# Altium schematic sheet Main.SchDoc
size A
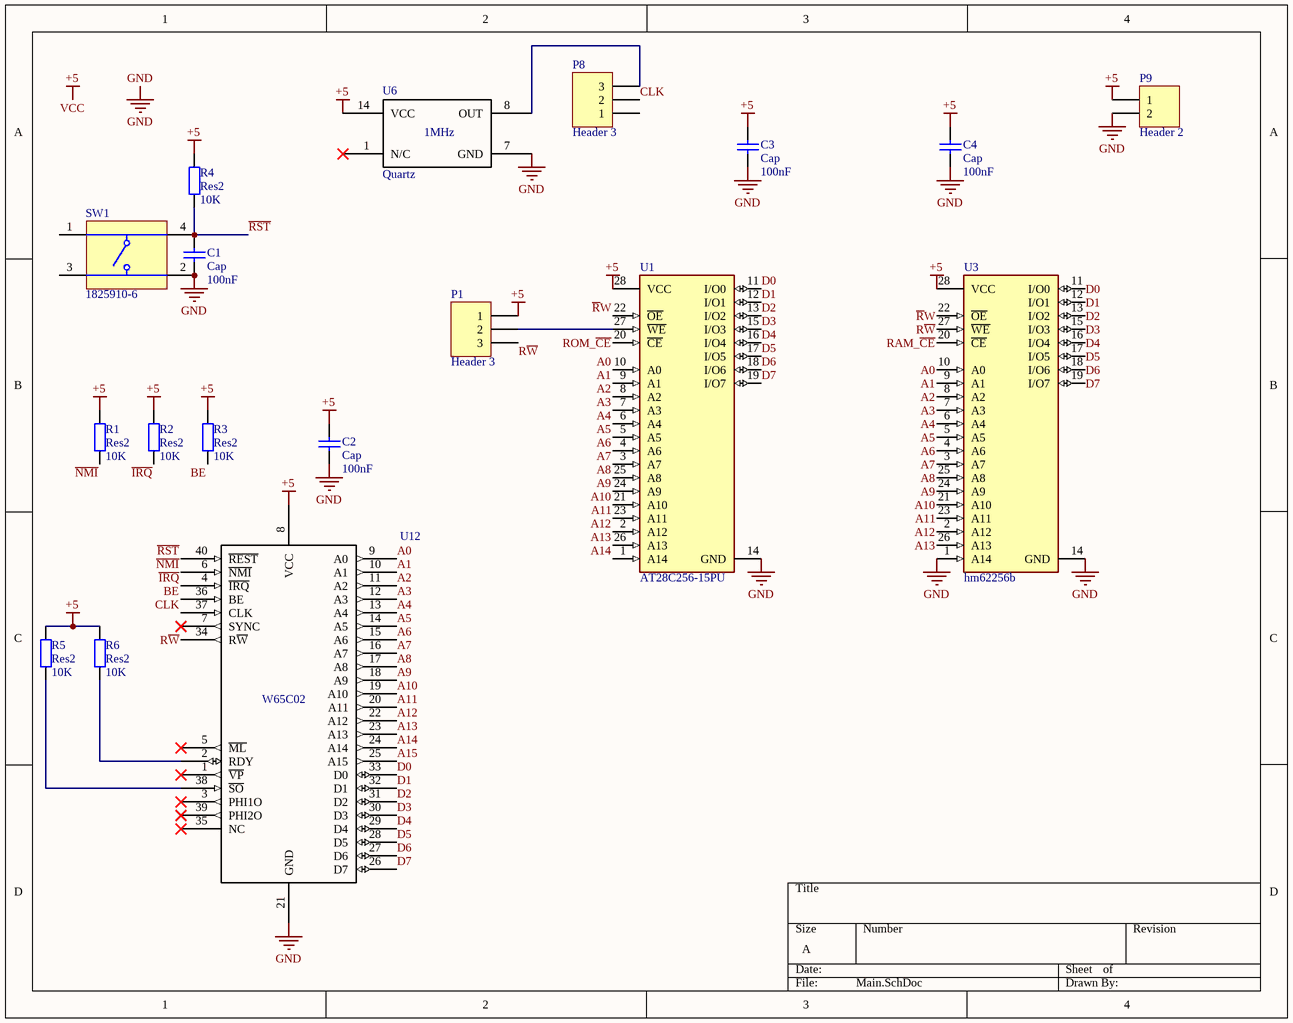
[diagram p0: Main.SchDoc]

## Parts
C1  Cap  value 100nF  [Ceramic Capacitor]
C2  Cap  value 100nF  [Ceramic Capacitor]
C3  Cap  value 100nF  [Ceramic Capacitor]
C4  Cap  value 100nF  [Ceramic Capacitor]
P1  Header 3  [HDR1X3]
P8  Header 3  [HDR1X3]
P9  Header 2  [HDR1X2]
R1  Res2  value 10K  [AXIAL-0.4]
R2  Res2  value 10K  [AXIAL-0.4]
R3  Res2  value 10K  [AXIAL-0.4]
R4  Res2  value 10K  [AXIAL-0.4]
R5  Res2  value 10K  [AXIAL-0.4]
R6  Res2  value 10K  [AXIAL-0.4]
SW1  1825910-6  [TECO-1825910-6_V]
U1  AT28C256-15PU  [FP-28P6-MFG]
U3  hm62256b  [FP-28P6-MFG]
U6  Quartz  [Quartz]
U12  W65C02  [DIP40]

## Nets
GND: C1.2 C2.2 C3.2 C4.2 P9.2 SW1.2 U1.14(GND) U3.1(A14) U3.14(GND) U6.7(GND) U12.21(GND)
VCC: C2.1 C3.1 C4.1 P1.1 P9.1 R1.2 R2.2 R3.2 R4.2 R5.2 R6.2 U1.28(VCC) U3.28(VCC) U6.14(VCC) U12.8(VCC)  [also labelled +5]
A0: U1.10(A0) U3.10(A0) U12.9(A0)
A1: U1.9(A1) U3.9(A1) U12.10(A1)
A2: U1.8(A2) U3.8(A2) U12.11(A2)
A3: U1.7(A3) U3.7(A3) U12.12(A3)
A4: U1.6(A4) U3.6(A4) U12.13(A4)
A5: U1.5(A5) U3.5(A5) U12.14(A5)
A6: U1.4(A6) U3.4(A6) U12.15(A6)
A7: U1.3(A7) U3.3(A7) U12.16(A7)
A8: U1.25(A8) U3.25(A8) U12.17(A8)
A9: U1.24(A9) U3.24(A9) U12.18(A9)
A10: U1.21(A10) U3.21(A10) U12.19(A10)
A11: U1.23(A11) U3.23(A11) U12.20(A11)
A12: U1.2(A12) U3.2(A12) U12.22(A12)
A13: U1.26(A13) U3.26(A13) U12.23(A13)
A14: U1.1(A14) U12.24(A14)
A15: U12.25(A15)
BE: R3.1 U12.36(BE)
CLK: P8.2 U12.37(CLK)
D0: U1.11(I/O0) U3.11(I/O0) U12.33(D0)
D1: U1.12(I/O1) U3.12(I/O1) U12.32(D1)
D2: U1.13(I/O2) U3.13(I/O2) U12.31(D2)
D3: U1.15(I/O3) U3.15(I/O3) U12.30(D3)
D4: U1.16(I/O4) U3.16(I/O4) U12.29(D4)
D5: U1.17(I/O5) U3.17(I/O5) U12.28(D5)
D6: U1.18(I/O6) U3.18(I/O6) U12.27(D6)
D7: U1.19(I/O7) U3.19(I/O7) U12.26(D7)
~{IRQ}: R2.1 U12.4(~{IRQ})
~{NMI}: R1.1 U12.6(~{NMI})
~{RST}: C1.1 R4.1 SW1.4 U12.40(~{REST})
~{R}W: U1.22(~{OE}) U3.22(~{OE})
RAM_~{CE}: U3.20(~{CE})
ROM_~{CE}: U1.20(~{CE})
R~{W}: P1.3 U3.27(~{WE}) U12.34(R~{W})
NetP1_2: P1.2 U1.27(~{WE})
NetP8_3: P8.3 U6.8(OUT)
NetR5_1: R5.1 U12.38(~{SO})
NetR6_1: R6.1 U12.2(RDY)

Not connected (* = marked no-connect by the designer): P8 1; SW1 1 3; U6 1(N/C)*; U12 1(~{VP})* 3(PHI1O)* 5(~{ML})* 7(SYNC)* 35(NC)* 39(PHI2O)*

## Notes on the sheet
- (in symbol Quartz) 1MHz

## Library data of the parts
C1-C4 = Cap: Capacitor; Published: 8-Jun-2000; LatestRevisionDate: 17-Jul-2002; LatestRevisionNote: Re-released for DXP Platform.; PackageReference: RAD-0.3; Publisher: Altium Limited; PackageDescription: Radial Cap, Thru-Hole; 2 Leads; 0.3 in Pin Spacing
P1 P8 = Header 3: Header, 3-Pin; LatestRevisionDate: 17-Jul-2002; LatestRevisionNote: Re-released for DXP Platform.; Publisher: Altium Limited
P9 = Header 2: Header, 2-Pin; LatestRevisionDate: 17-Jul-2002; LatestRevisionNote: Re-released for DXP Platform.; Publisher: Altium Limited
R1-R6 = Res2: Resistor; Published: 8-Jun-2000; LatestRevisionDate: 17-Jul-2002; LatestRevisionNote: Re-released for DXP Platform.; PackageReference: AXIAL-0.4; Publisher: Altium Limited; PackageDescription: Axial Device, Thru-Hole; 2 Leads; 0.4 in Pin Spacing
SW1 = CMP-1684-00021-1: Tact Switch, SPST-NO, 0.05 A, -35 to 85 degC, 4-Pin THD, RoHS, Bulk; Manufacturer: TE Connectivity; Maximum Contact Resistance: 100mOhm; Mechanical Life: 100000Cycles; Bushing Type: Unthreaded; Switch Configuration: OFF(ON); Maximum DC Voltage Rating: 24V; Contact Rating @ Voltage: 0.05A@24VDC; Actuator Color: Black; Body Orientation: Straight; Function: MomentaryContact; Illumination: N/R; Actuator Style: RoundButton; Actuator Material: PolybutyleneTerephthalate; Dielectric Strength: 500VAC; Pole Throw Configuration: SPST; Actuator Length: 1.4mm; Product Weight: N/A; Contact Material: CopperAlloy; Housing Material: N/A; Terminal Type: PCPins; Minimum Insulation Resistance: 100MOhm; Package Description: 4-Pin Through Hole Device, Body 5.99 x 5.99 mm, Pitch 6.5 mm; Part No: 1825910-6; Package Reference: THD; Base Material: N/A; Manufacturer URL: http://www.te.com; Contact Plating: Silver; RoHS: Yes; Datasheet Version: Rev. C9; Electrical Life: 100000Cycles; Maximum AC Voltage Rating: N/A; Thread Size: N/R; Operating Temperature: -35to85C; Mounting: ThroughHole; Dimension: 5.99x5mm; Datasheet URL: http://www.te.com/commerce/DocumentDelivery/DDEController?Action=showdoc&DocId=Customer+Drawing%7F1825910%7FC9%7Fpdf%7FEnglish%7FENG_CD_1825910_C9.pdf%7F1825910-6; Family: 1825910; Seal Location: N/A; Seal Description: N/A; Packaging: N/A
U1 = CMP-06313-000003-1: IC EEPROM 256K PARALLEL 28DIP; Manufacturer: Microchip; Max Supply Voltage: 5.5V; Nominal Supply Current: 50mA; Memory Size: 256Kbits; Access Time: 150ns; Min Supply Voltage: 4.5V; Standoff Height: 0.381mm; Digikey Description: IC EEPROM 256K PARALLEL 28DIP; Device Class L3: EEPROM; Temperature: -40°C to +85°C; RoHS: TRUE; Device Class L1: Integrated Circuits (ICs); ComponentLink2Description: Datasheet; Memory Type: EEPROM; Package: 28P6; Interface: Parallel; Manufacturer Part Number: AT28C256-15PU; Device Class L2: Memory; ComponentLink2URL: http://ww1.microchip.com/downloads/en/DeviceDoc/doc0006.pdf; Temperature Range Low: -40°C; Category: IC; Lead Free: Yes; Automotive: No; Ipc Land Pattern Name: DIP1556W46P254L3734H483Q28; Height: 4.826mm; Octopart: https://octopart.com/at28c256-15pu-microchip-77758240; Temperature Range High: +85°C
U3 = CMP-06313-000003-1: RAM; Manufacturer Part Number: AT28C256-15PU; Manufacturer: Microchip; Max Supply Voltage: 5.5V; Memory Type: EEPROM; Interface: Parallel; Nominal Supply Current: 50mA; Memory Size: 256Kbits; Access Time: 150ns; Min Supply Voltage: 4.5V; Standoff Height: 0.381mm; Digikey Description: IC EEPROM 256K PARALLEL 28DIP; Device Class L3: EEPROM; Temperature: -40°C to +85°C; RoHS: TRUE; Device Class L1: Integrated Circuits (ICs); ComponentLink2Description: Datasheet; Package: 28P6; Device Class L2: Memory; ComponentLink2URL: http://ww1.microchip.com/downloads/en/DeviceDoc/doc0006.pdf; Temperature Range Low: -40°C; Category: IC; Lead Free: Yes; Automotive: No; Ipc Land Pattern Name: DIP1556W46P254L3734H483Q28; Height: 4.826mm; Octopart: https://octopart.com/at28c256-15pu-microchip-77758240; Temperature Range High: +85°C